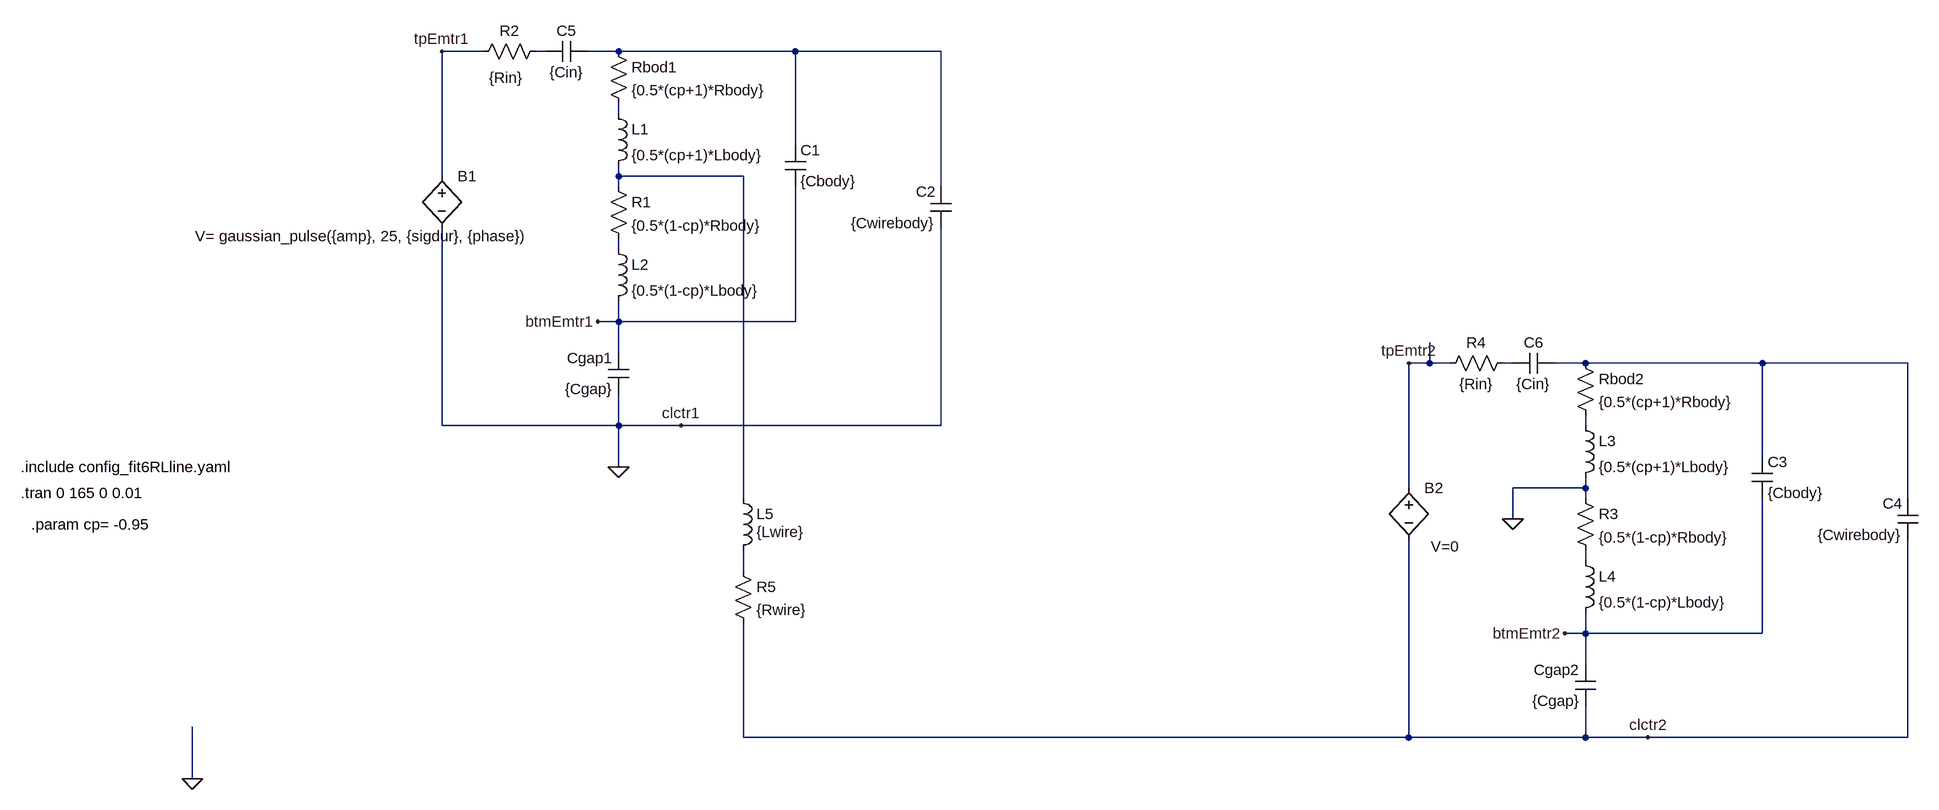
[diagram p0: schematic memcell_nc_LR_wire.asc]
memcell_nc_LR_wire.asc, the LTspice schematic file:
Version 4
SHEET 1 2780 1444
WIRE -384 -304 -448 -304
WIRE -288 -304 -304 -304
WIRE -176 -304 -224 -304
WIRE 96 -304 -176 -304
WIRE 320 -304 96 -304
WIRE -176 -208 -176 -224
WIRE 96 -160 96 -304
WIRE -448 -112 -448 -304
WIRE -176 -112 -176 -128
WIRE 16 -112 -176 -112
WIRE -176 -96 -176 -112
WIRE 320 -96 320 -304
WIRE -176 0 -176 -16
WIRE -176 112 -176 80
WIRE -176 112 -208 112
WIRE 96 112 96 -96
WIRE 96 112 -176 112
WIRE -176 160 -176 112
WIRE 1072 176 1072 144
WIRE 1072 176 1040 176
WIRE 1104 176 1072 176
WIRE 1200 176 1184 176
WIRE 1312 176 1264 176
WIRE 1584 176 1312 176
WIRE 1808 176 1584 176
WIRE -448 272 -448 -32
WIRE -176 272 -176 224
WIRE -176 272 -448 272
WIRE -80 272 -176 272
WIRE 320 272 320 -32
WIRE 320 272 -80 272
WIRE 1312 272 1312 256
WIRE 1584 320 1584 176
WIRE -176 336 -176 272
WIRE 1040 368 1040 176
WIRE 1312 368 1312 352
WIRE 1312 368 1200 368
WIRE 16 384 16 -112
WIRE 1312 384 1312 368
WIRE 1808 384 1808 176
WIRE 1200 416 1200 368
WIRE 1312 480 1312 464
WIRE 16 496 16 464
WIRE 1312 592 1312 560
WIRE 1312 592 1280 592
WIRE 1584 592 1584 384
WIRE 1584 592 1312 592
WIRE 1312 640 1312 592
WIRE 16 752 16 576
WIRE 1040 752 1040 448
WIRE 1040 752 16 752
WIRE 1312 752 1312 704
WIRE 1312 752 1040 752
WIRE 1408 752 1312 752
WIRE 1808 752 1808 448
WIRE 1808 752 1408 752
WIRE -832 816 -832 736
FLAG -208 112 btmEmtr1
FLAG -80 272 clctr1
FLAG -448 -304 tpEmtr1
FLAG 1280 592 btmEmtr2
FLAG 1408 752 clctr2
FLAG 1040 176 tpEmtr2
FLAG -176 336 0
FLAG -832 816 0
FLAG 1200 416 0
SYMBOL bv -448 -128 R0
WINDOW 3 -380 108 Left 2
SYMATTR Value V= gaussian_pulse({amp}, 25, {sigdur}, {phase})
SYMATTR InstName B1
SYMBOL cap 80 -160 R0
SYMATTR InstName C1
SYMATTR Value {Cbody}
SYMBOL cap -160 224 R180
WINDOW 0 24 56 Left 2
WINDOW 3 24 8 Left 2
SYMATTR InstName Cgap1
SYMATTR Value {Cgap}
SYMBOL cap 336 -32 R180
WINDOW 0 24 56 Left 2
WINDOW 3 24 8 Left 2
SYMATTR InstName C2
SYMATTR Value {Cwirebody}
SYMBOL res -192 -320 R0
SYMATTR InstName Rbod1
SYMATTR Value {0.5*(cp+1)*Rbody}
SYMBOL res -192 -112 R0
SYMATTR InstName R1
SYMATTR Value {0.5*(1-cp)*Rbody}
SYMBOL ind -192 -224 R0
SYMATTR InstName L1
SYMATTR Value {0.5*(cp+1)*Lbody}
SYMBOL ind -192 -16 R0
SYMATTR InstName L2
SYMATTR Value {0.5*(1-cp)*Lbody}
SYMBOL res -288 -320 R90
WINDOW 0 0 56 VBottom 2
WINDOW 3 41 61 VTop 2
SYMATTR InstName R2
SYMATTR Value {Rin}
SYMBOL bv 1040 352 R0
WINDOW 3 34 106 Left 2
SYMATTR Value V=0
SYMATTR InstName B2
SYMBOL cap 1568 320 R0
SYMATTR InstName C3
SYMATTR Value {Cbody}
SYMBOL cap 1328 704 R180
WINDOW 0 24 56 Left 2
WINDOW 3 24 8 Left 2
SYMATTR InstName Cgap2
SYMATTR Value {Cgap}
SYMBOL cap 1824 448 R180
WINDOW 0 24 56 Left 2
WINDOW 3 24 8 Left 2
SYMATTR InstName C4
SYMATTR Value {Cwirebody}
SYMBOL res 1296 160 R0
SYMATTR InstName Rbod2
SYMATTR Value {0.5*(cp+1)*Rbody}
SYMBOL res 1296 368 R0
SYMATTR InstName R3
SYMATTR Value {0.5*(1-cp)*Rbody}
SYMBOL ind 1296 256 R0
SYMATTR InstName L3
SYMATTR Value {0.5*(cp+1)*Lbody}
SYMBOL ind 1296 464 R0
SYMATTR InstName L4
SYMATTR Value {0.5*(1-cp)*Lbody}
SYMBOL res 1200 160 R90
WINDOW 0 0 56 VBottom 2
WINDOW 3 32 56 VTop 2
SYMATTR InstName R4
SYMATTR Value {Rin}
SYMBOL cap -224 -320 R90
WINDOW 0 0 32 VBottom 2
WINDOW 3 32 32 VTop 2
SYMATTR InstName C5
SYMATTR Value {Cin}
SYMBOL cap 1264 160 R90
WINDOW 0 0 32 VBottom 2
WINDOW 3 32 32 VTop 2
SYMATTR InstName C6
SYMATTR Value {Cin}
SYMBOL ind 0 368 R0
WINDOW 3 36 68 Left 2
SYMATTR Value {Lwire}
SYMATTR InstName L5
SYMBOL res 0 480 R0
SYMATTR InstName R5
SYMATTR Value {Rwire}
TEXT -1096 376 Left 2 !.tran 0 165 0 0.01
TEXT -1096 336 Left 2 !.include config_fit6RLline.yaml
TEXT -1080 424 Left 2 !.param cp= -0.95

The netlist it stands for:
* memcell_nc_LR_wire.asc
B1 tpEmtr1 0 V= gaussian_pulse({amp}, 25, {sigdur}, {phase})
C1 N002 btmEmtr1 {Cbody}
Cgap1 0 btmEmtr1 {Cgap}
C2 0 N002 {Cwirebody}
Rbod1 N002 N003 {0.5*(cp+1)*Rbody}
R1 N004 N005 {0.5*(1-cp)*Rbody}
L1 N003 N004 {0.5*(cp+1)*Lbody}
L2 N005 btmEmtr1 {0.5*(1-cp)*Lbody}
R2 N001 tpEmtr1 {Rin}
B2 tpEmtr2 clctr2 V=0
C3 N007 btmEmtr2 {Cbody}
Cgap2 clctr2 btmEmtr2 {Cgap}
C4 clctr2 N007 {Cwirebody}
Rbod2 N007 N008 {0.5*(cp+1)*Rbody}
R3 0 N009 {0.5*(1-cp)*Rbody}
L3 N008 0 {0.5*(cp+1)*Lbody}
L4 N009 btmEmtr2 {0.5*(1-cp)*Lbody}
R4 N006 tpEmtr2 {Rin}
C5 N002 N001 {Cin}
C6 N007 N006 {Cin}
L5 N004 N010 {Lwire}
R5 N010 clctr2 {Rwire}
.tran 0 165 0 0.01
.include config_fit6RLline.yaml
.param cp= -0.95
.backanno
.end